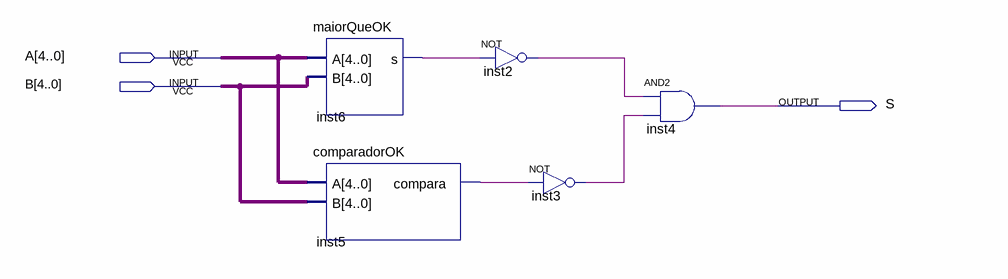
[diagram p0: schematic sheet]
// Quartus schematic menorQueOK.bdf as structural Verilog: 5 symbols, 3 pins
module menorQueOK (
  input  [4:0] A,
  input  [4:0] B,
  output S
);

  wire inst2_out, inst3_out, inst5_compara, inst6_s;

  maiorQueOK inst6 (.A(A), .B(B), .s(inst6_s));
  comparadorOK inst5 (.A(A), .B(B), .compara(inst5_compara));
  not inst2 (inst2_out, inst6_s);
  not inst3 (inst3_out, inst5_compara);
  and inst4 (S, inst2_out, inst3_out);
endmodule
